# Altium schematic sheet Rx_Universal_Schematic.SchDoc: Universal IR Receiver with MFB Filter
size A3; Author: Duleepa J Thrimawithana; Organization: Power Electronics Group; Address1: The University of Auckland; Address2: 20 Symonds Street; Address3: Auckland 1010; Address4: New Zealand; Revision: 1R0; SheetNumber: 1; SheetTotal: 1
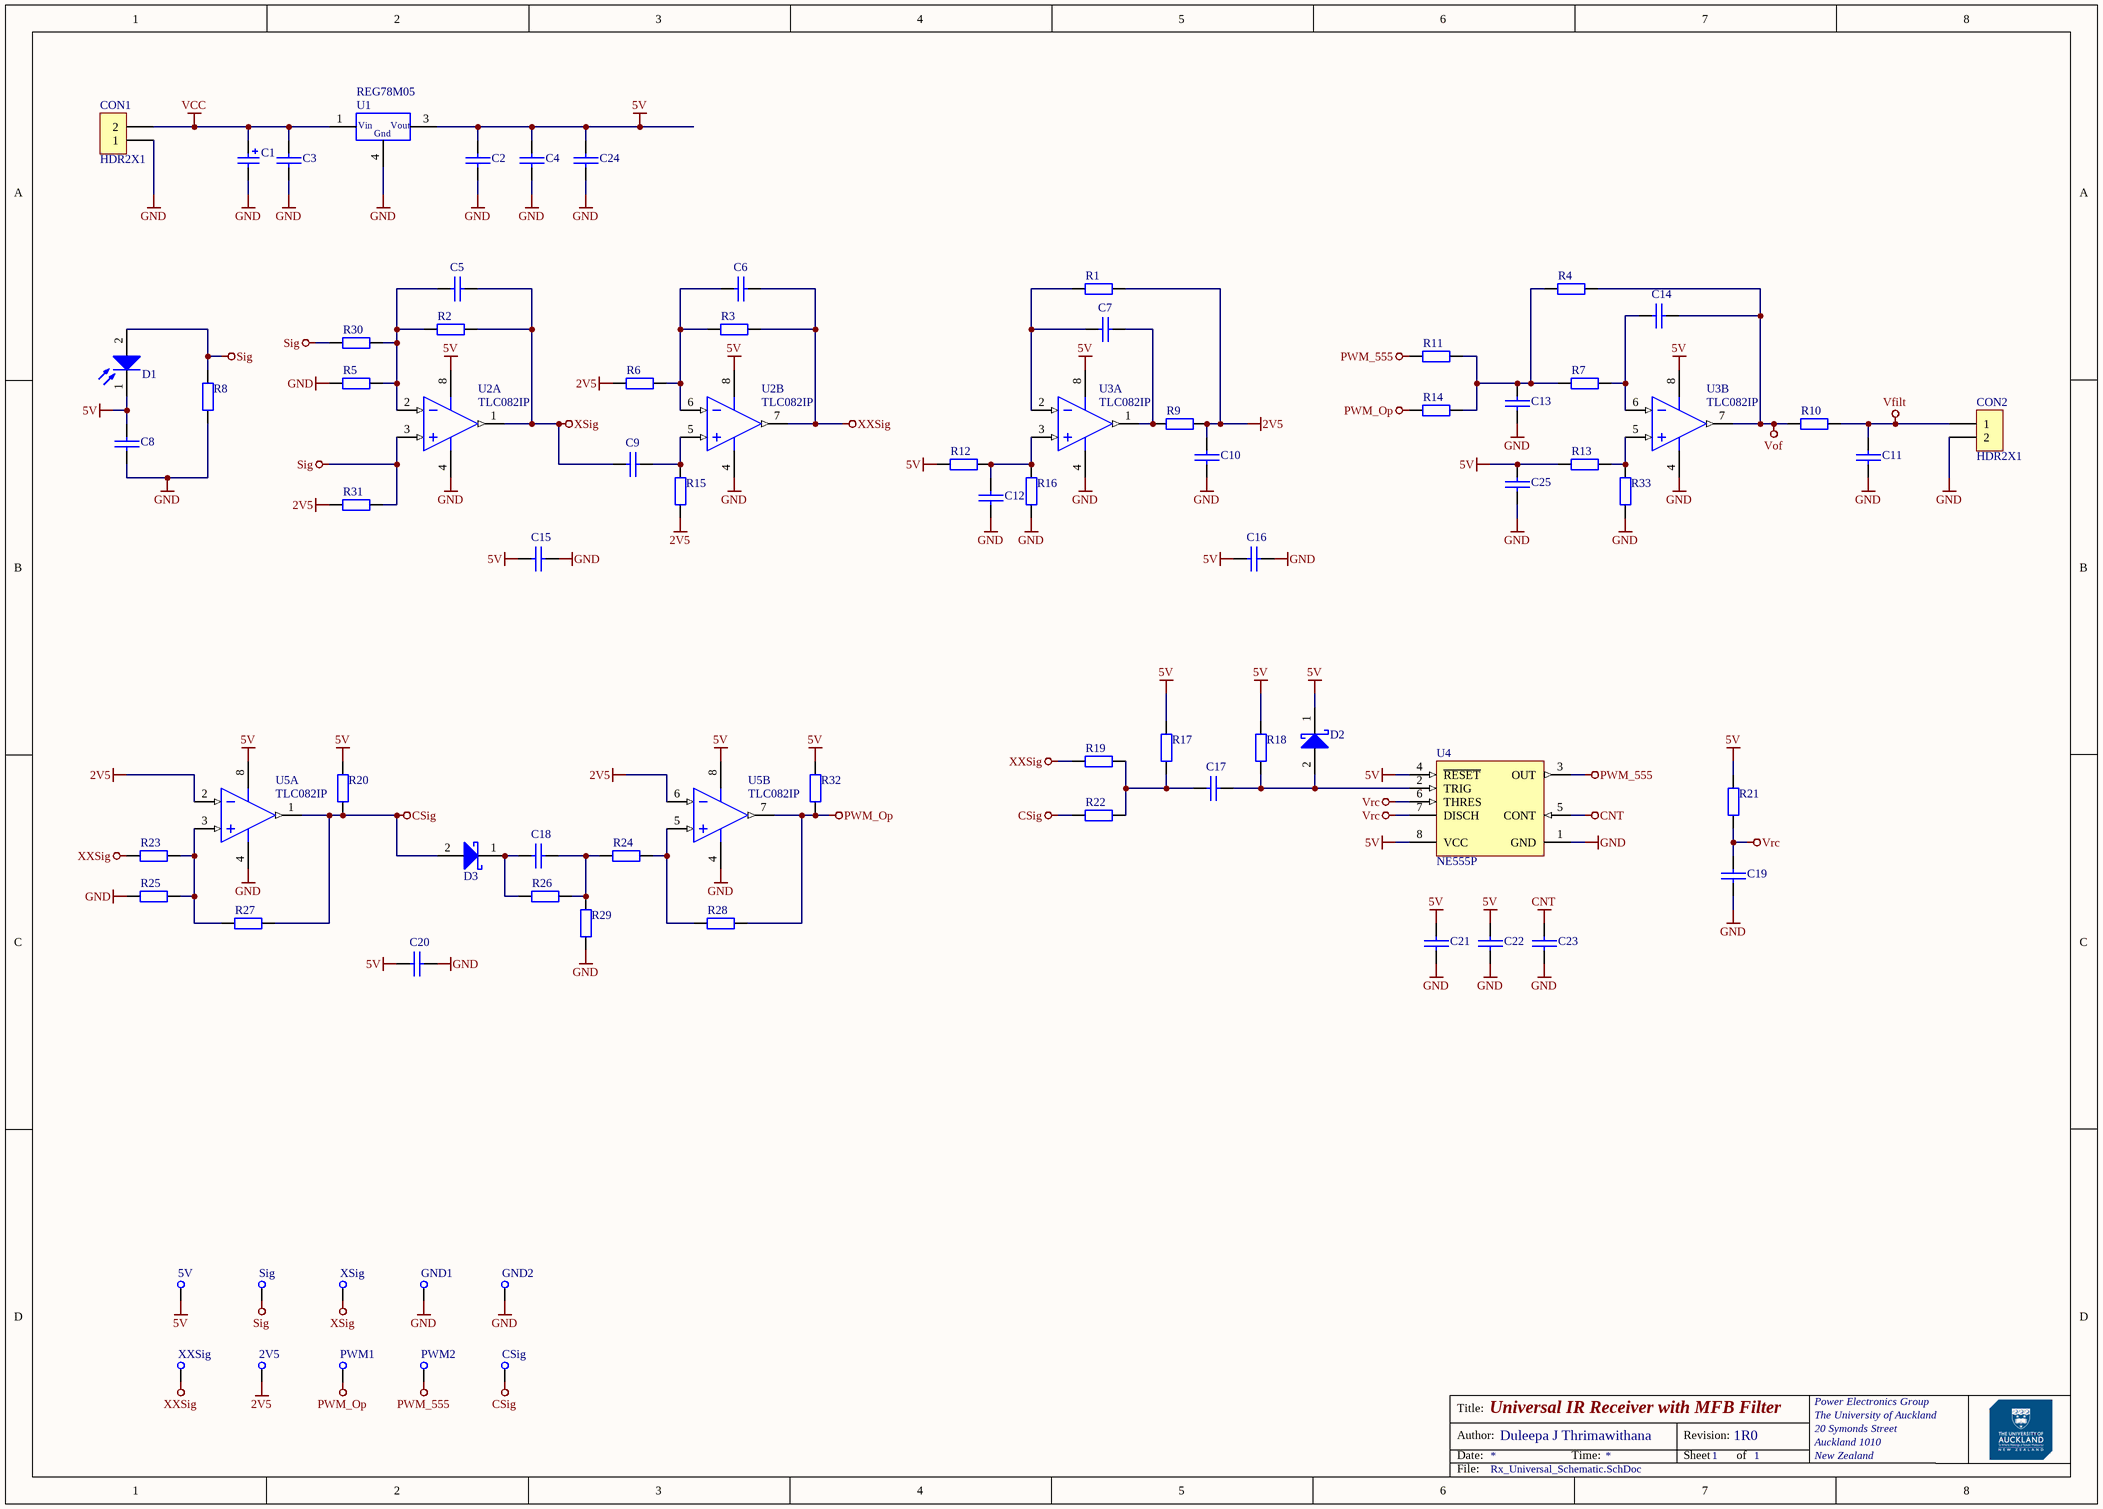
[diagram p0: Rx_Universal_Schematic.SchDoc]

## Parts
2V5  TP TH  [TP_TH_2.5mm]  (value not drawn)
5V  TP TH  [TP_TH_2.5mm]  (value not drawn)
C1  ECAP  [CR05]  (value not drawn)
C2  CCAP_TH_5P0  [CCAP_5P0]  (value not drawn)
C3  CCAP_TH_5P0  [CCAP_5P0]  (value not drawn)
C4  CCAP_TH_5P0  [CCAP_5P0]  (value not drawn)
C5  CCAP_TH_5P0  [CCAP_5P0]  (value not drawn)
C6  CCAP_TH_5P0  [CCAP_5P0]  (value not drawn)
C7  CCAP_TH_5P0  [CCAP_5P0]  (value not drawn)
C8  CCAP_TH_5P0  [CCAP_5P0]  (value not drawn)
C9  CCAP_TH_5P0  [CCAP_5P0]  (value not drawn)
C10  CCAP_TH_5P0  [CCAP_5P0]  (value not drawn)
C11  CCAP_TH_5P0  [CCAP_5P0]  (value not drawn)
C12  CCAP_TH_5P0  [CCAP_5P0]  (value not drawn)
C13  CCAP_TH_5P0  [CCAP_5P0]  (value not drawn)
C14  CCAP_TH_5P0  [CCAP_5P0]  (value not drawn)
C15  CCAP_TH_5P0  [CCAP_5P0]  (value not drawn)
C16  CCAP_TH_5P0  [CCAP_5P0]  (value not drawn)
C17  CCAP_TH_5P0  [CCAP_5P0]  (value not drawn)
C18  CCAP_TH_5P0  [CCAP_5P0]  (value not drawn)
C19  CCAP_TH_5P0  [CCAP_5P0]  (value not drawn)
C20  CCAP_TH_5P0  [CCAP_5P0]  (value not drawn)
C21  CCAP_TH_5P0  [CCAP_5P0]  (value not drawn)
C22  CCAP_TH_5P0  [CCAP_5P0]  (value not drawn)
C23  CCAP_TH_5P0  [CCAP_5P0]  (value not drawn)
C24  CCAP_TH_5P0  [CCAP_5P0]  (value not drawn)
C25  CCAP_TH_5P0  [CCAP_5P0]  (value not drawn)
CON1  HDR2X1  [HDR2X1_2P54]
CON2  HDR2X1  [HDR2X1_2P54]
CSig  TP TH  [TP_TH_2.5mm]  (value not drawn)
D1  PhotoD_TH  [TH_LED]  (value not drawn)
D2  BAT85,113  [FP-SOD68-MFG]  (value not drawn)
D3  BAT85,113  [FP-SOD68-MFG]  (value not drawn)
GND1  TP TH  [TP_TH_2.5mm]  (value not drawn)
GND2  TP TH  [TP_TH_2.5mm]  (value not drawn)
PWM1  TP TH  [TP_TH_2.5mm]  (value not drawn)
PWM2  TP TH  [TP_TH_2.5mm]  (value not drawn)
R1  RESAX4  [RAX4]  (value not drawn)
R2  RESAX4  [RAX4]  (value not drawn)
R3  RESAX4  [RAX4]  (value not drawn)
R4  RESAX4  [RAX4]  (value not drawn)
R5  RESAX4  [RAX4]  (value not drawn)
R6  RESAX4  [RAX4]  (value not drawn)
R7  RESAX4  [RAX4]  (value not drawn)
R8  RESAX4  [RAX4]  (value not drawn)
R9  RESAX4  [RAX4]  (value not drawn)
R10  RESAX4  [RAX4]  (value not drawn)
R11  RESAX4  [RAX4]  (value not drawn)
R12  RESAX4  [RAX4]  (value not drawn)
R13  RESAX4  [RAX4]  (value not drawn)
R14  RESAX4  [RAX4]  (value not drawn)
R15  RESAX4  [RAX4]  (value not drawn)
R16  RESAX4  [RAX4]  (value not drawn)
R17  RESAX4  [RAX4]  (value not drawn)
R18  RESAX4  [RAX4]  (value not drawn)
R19  RESAX4  [RAX4]  (value not drawn)
R20  RESAX4  [RAX4]  (value not drawn)
R21  RESAX4  [RAX4]  (value not drawn)
R22  RESAX4  [RAX4]  (value not drawn)
R23  RESAX4  [RAX4]  (value not drawn)
R24  RESAX4  [RAX4]  (value not drawn)
R25  RESAX4  [RAX4]  (value not drawn)
R26  RESAX4  [RAX4]  (value not drawn)
R27  RESAX4  [RAX4]  (value not drawn)
R28  RESAX4  [RAX4]  (value not drawn)
R29  RESAX4  [RAX4]  (value not drawn)
R30  RESAX4  [RAX4]  (value not drawn)
R31  RESAX4  [RAX4]  (value not drawn)
R32  RESAX4  [RAX4]  (value not drawn)
R33  RESAX4  [RAX4]  (value not drawn)
Sig  TP TH  [TP_TH_2.5mm]  (value not drawn)
U1  REG78M05  [TO220_Reg]
U2  TLC082IP  [P0008A]  (parts A,B of 2)
U3  TLC082IP  [P0008A]  (parts A,B of 2)
U4  NE555P  [P0008A]
U5  TLC082IP  [P0008A]  (parts A,B of 2)
XSig  TP TH  [TP_TH_2.5mm]  (value not drawn)
XXSig  TP TH  [TP_TH_2.5mm]  (value not drawn)

## Nets
2V5: 2V5.1 C10.1 R1.1 R6.2 R9.1 R15.1 R31.2 U5.2(IN1-) U5.6(IN2-)
5V: 5V.1 C2.2 C4.2 C8.2 C15.2 C16.2 C20.2 C21.2 C22.2 C24.2 C25.2 D1.1(C) D2.1(C) R12.2 R13.2 R17.2 R18.2 R20.1 R21.2 R32.1 U1.3(Vout) U2.8(VDD) U3.8(VDD) U4.4(~{RESET}) U4.8(VCC) U5.8(VDD)
CNT: C23.2 U4.5(CONT)
CSig: CSig.1 D3.2(A) R20.2 R22.2 R27.1 U5.1(OUT1)
GND: C1.2 C2.1 C3.1 C4.1 C8.1 C10.2 C11.1 C12.2 C13.1 C15.1 C16.1 C19.1 C20.1 C21.1 C22.1 C23.1 C24.1 C25.1 CON1.1 CON2.2 GND1.1 GND2.1 R5.2 R8.1 R16.1 R25.2 R29.2 R33.2 U1.4(Gnd) U2.4(GND) U3.4(GND) U4.1(GND) U5.4(GND)
PWM_555: PWM2.1 R11.2 U4.3(OUT)
PWM_Op: PWM1.1 R14.2 R28.1 R32.2 U5.7(OUT2)
Sig: D1.2(A) R8.2 R30.2 R31.1 Sig.1 U2.3(IN1+)
VCC: C1.1 C3.2 CON1.2 U1.1(Vin)
Vfilt: C11.2 CON2.1 R10.1
Vof: C14.2 R4.1 R10.2 U3.7(OUT2)
Vrc: C19.2 R21.1 U4.6(THRES) U4.7(DISCH)
XSig: C5.1 C9.2 R2.1 U2.1(OUT1) XSig.1
XXSig: C6.1 R3.1 R19.2 R23.2 U2.7(OUT2) XXSig.1
NetC5_2: C5.2 R2.2 R5.1 R30.1 U2.2(IN1-)
NetC6_2: C6.2 R3.2 R6.1 U2.6(IN2-)
NetC7_1: C7.1 R9.2 U3.1(OUT1)
NetC7_2: C7.2 R1.2 U3.2(IN1-)
NetC9_1: C9.1 R15.2 U2.5(IN2+)
NetC12_1: C12.1 R12.1 R16.2 U3.3(IN1+)
NetC13_2: C13.2 R4.2 R7.2 R11.1 R14.1
NetC14_1: C14.1 R7.1 U3.6(IN2-)
NetC17_1: C17.1 D2.2(A) R18.1 U4.2(TRIG)
NetC17_2: C17.2 R17.1 R19.1 R22.1
NetC18_1: C18.1 R24.2 R26.1 R29.1
NetC18_2: C18.2 D3.1(C) R26.2
NetR13_1: R13.1 R33.1 U3.5(IN2+)
NetR23_1: R23.1 R25.1 R27.2 U5.3(IN1+)
NetR24_1: R24.1 R28.2 U5.5(IN2+)

## Notes on the sheet
- Title:
- Author:
- Date:
- Time:
- Revision:
- Sheet
- of
- File:

## Library data of the parts
2V5 5V CSig GND1 GND2 PWM1 PWM2 Sig XSig XXSig = CMP-046-000000-3: Testpoint through hole / Keystone compact / 5000 - Red / 5001 - Black / 5002 - White / 5003 - Orange / 5004 - Yellow; Source: UoAPE_Connectors and Mechanical.SchLib; Design Item ID: TP TH
C1 = CMP-003-000000-2: Source: CommonSymbols_V1.SchLib; Design Item ID: ECAP
C2-C25 = CMP-001-00023-1: TH ceramic cap with 5mm pitch; Design Item ID: CCAP_5P0
CON1 CON2 = CMP-004-000000-7: Header 2X1; Design Item ID: HDR2X1; Source: CommonSymbols_V1.SchLib
D1 = CMP-007-00003-1: Photo diode
D2 D3 = CMP-00011-1: Rectifier Diode, Schottky, 1 Phase, 1 Element, 0.2A, 30V V(RRM), Silicon, DO-34; Time @ Peak Reflow Temperature-Max (s): 40s; Number of Elements: 1; Max Power Dissipation: 200mW; Forward Voltage: 800mV; Non-rep Pk Forward Current-Max: 600mA; Case Connection: Isolated; Package Body Material: Glass; Max Reverse Current: 2uA; Max Output current: 200mA; Reverse Recovery Time-Max: 0.004us; Surface Mount: No; Qualification Status: Not Qualified; JESD-609 Code: e3; Min Operating Temperature: -55°C; Reach SVHC Compliant: Yes; Terminal Finish: Tin; JEDEC-95 Code: DO-34; Technology: SCHOTTKY; Package Style: LONG FORMMeter; Moisture Sensitivity Level: 1; Terminal Form: Wire; JESD-30 Code: O-LALF-W2; Peak Reflow Temperature (Cel): 260°C; Max Operating Temperature: 125°C; Pins: 2; RoHS Compliant: Yes; Diode Type: RECTIFIER; Diode Element Material: SILICON; Rep Pk Reverse Voltage-Max: 30V; Terminal Position: AXIAL; Package Shape: Round
R1-R33 = CMP-010-000001-2: Axial Resistor; Design Item ID: RESAX4; Source: CommonSymbols_V1.SchLib
U1 = CMP-011-000018-2: 78M Series Linear Regulators; Source: CommonSymbols_V1.SchLib; Design Item ID: REG78MXX
U2 U3 U5 = CMP-014-00006-1: Operational Amplifier, 2 Func, 3000uV Offset-Max, BIMOS, PDIP8; Max Supply Current: 7mA; Frequency Compensation: YES; Package Equivalence Code: DIP8,.3; Low-Offset: No; Average Bias Current-Max (IIB): 700pA; Power: 100mW; Supply Voltage Limit-Max: 17V; Package Body Material: Plastic; Common-mode Reject Ratio-Nom: 110dB; Input Offset Voltage-Max: 3mV; Unity Gain BW-Nom: 10MHz; Bias Current-Max (IIB) @25C: 50pA; Slew Rate: 16V/µs; Architecture: VOLTAGE-FEEDBACK; Qualification Status: Not Qualified; Slew Rate-Min: 9.5V/µs; Nominal Supply Voltage: 5V; Voltage Gain-Min: 100000; Channels: 2; Surface Mount: No; Power Supplies: +-2.25/+-8/4.5/16V; Case/Package: DIP; Length: 9.81mm; Terminal Form: Through Hole; Terminal Finish: Nickel; Technology: BIMOS; Low-Bias: Yes; Package Style: IN-LINEMeter; Wideband: No; Height - Seated (Max): 5.08mm; Temperature Grade: AUTOMOTIVE; Terminal Position: DUAL; Packaging: Rail/Tube; JESD-609 Code: e4; Package Shape: Rectangular; Amplifier Type: OPERATIONAL AMPLIFIER; Max Operating Temperature: 125°C; Width: 7.62mm; RoHS Compliant: Yes; Programmable Power: No; Reach SVHC Compliant: Yes; JESD-30 Code: R-PDIP-T8; Terminal Pitch: 2.54mm; Micropower: No; Min Operating Temperature: -40°C; Pins: 8
U4 = CMP-00023-00000-1: 1 Func, BIPolar, PDIP8; Package Body Material: Plastic; Surface Mount: No; Channels: 1; Power Supplies: 5/15V; Nominal Supply Voltage: 5V; Max Supply Voltage: 16V; Package Equivalence Code: DIP8,.3; Qualification Status: Not Qualified; Min Supply Voltage: 4.5V; Throw Configuration: PULSE; RECTANGULAR; Width: 7.62mm; Terminal Finish: Tin; Length: 9.81mm; Terminal Pitch: 2.54mm; Max Operating Temperature: 70°C; Terminal Position: DUAL; Pins: 8; Terminal Form: Through Hole; Min Operating Temperature: 0°C; Height - Seated (Max): 5.08mm; JESD-609 Code: e3; Temperature Grade: COMMERCIAL; Package Style: IN-LINEMeter; Case/Package: DIP; Package Shape: Rectangular; RoHS Compliant: Yes; Technology: BIPOLAR; Reach SVHC Compliant: Yes; JESD-30 Code: R-PDIP-T8